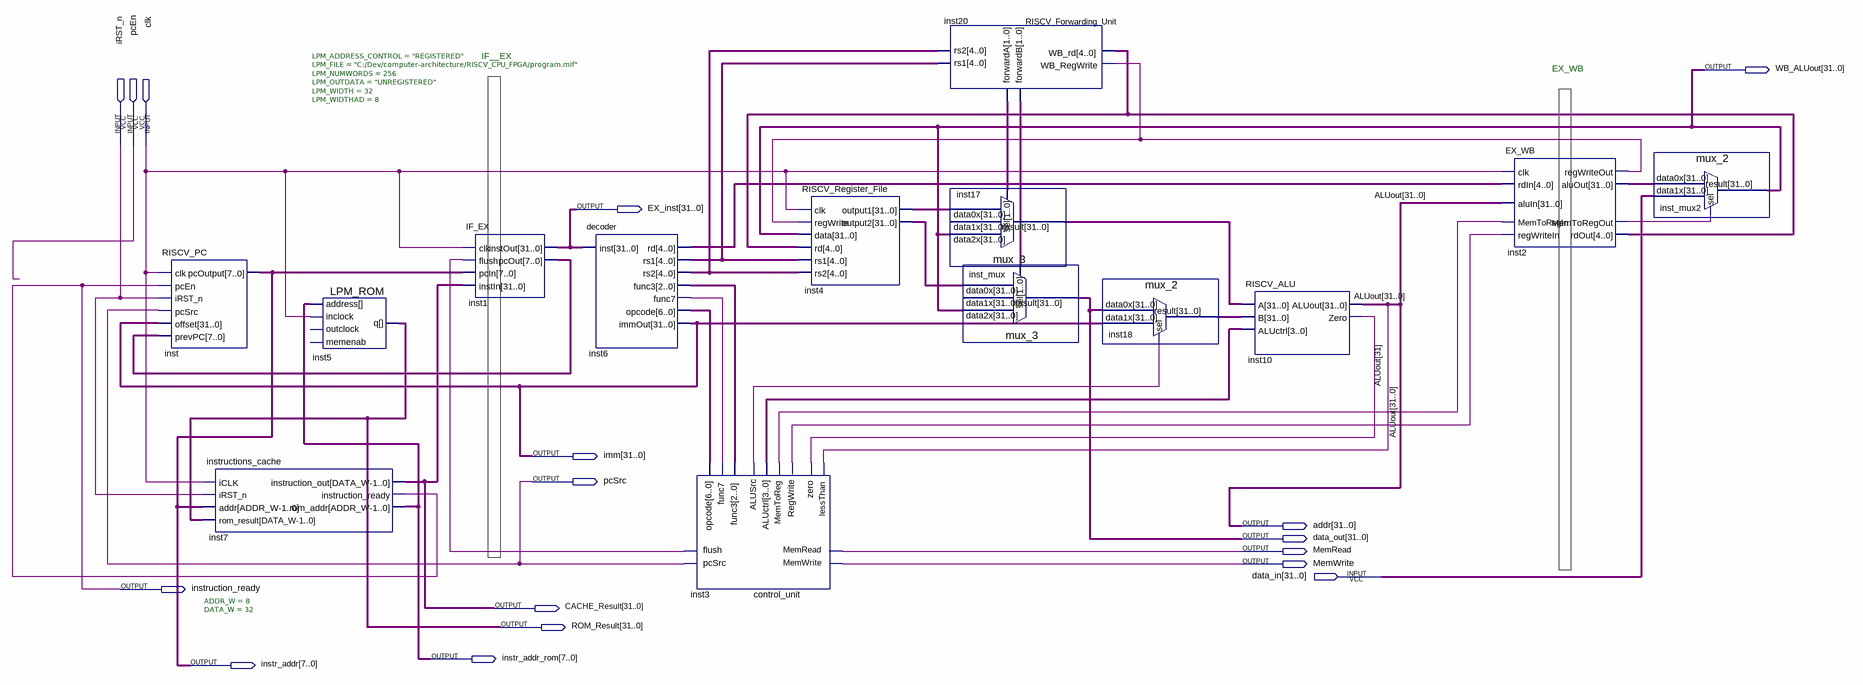
[diagram p0: schematic sheet]
// Quartus schematic CPU_pipelined.bdf as structural Verilog: 14 symbols, 17 pins
module CPU_pipelined (
  input  iRST_n,
  input  pcEn,
  input  clk,
  input  [31:0] data_in,
  output [31:0] WB_ALUout,
  output [31:0] EX_inst,
  output [31:0] imm,
  output pcSrc,
  output [31:0] addr,
  output [31:0] data_out,
  output MemRead,
  output MemWrite,
  output instruction_ready,
  output [31:0] CACHE_Result,
  output [31:0] ROM_Result,
  output [7:0] instr_addr_rom,
  output [7:0] instr_addr
);

  wire inst2_memtoregout, inst2_regwriteout, inst3_alusrc, inst3_flush, inst3_memtoreg, inst3_regwrite,
       inst6_func7, inst10_zero;
  wire [1:0] inst20_forwarda, inst20_forwardb;
  wire [2:0] inst6_func3;
  wire [3:0] inst3_aluctrl;
  wire [4:0] inst2_rdout, inst6_rd, inst6_rs1, inst6_rs2;
  wire [6:0] inst6_opcode;
  wire [7:0] inst1_pcout;
  wire [31:0] inst2_aluout, inst4_output1, inst4_output2, inst17_result, inst18_result;

  RISCV_PC inst (
    .clk(clk), .iRST_n(iRST_n), .pcSrc(pcSrc), .pcEn(instruction_ready), .offset(imm), .prevPC(inst1_pcout),
    .pcOutput(instr_addr));
  instructions_cache #(.ADDR_W(8), .DATA_W(32)) inst7 (
    .iCLK(clk), .iRST_n(iRST_n), .addr(instr_addr), .rom_result(ROM_Result), .instruction_out(CACHE_Result),
    .instruction_ready(instruction_ready), .rom_addr(instr_addr_rom));
  LPM_ROM #(.LPM_ADDRESS_CONTROL("REGISTERED"), .LPM_FILE("C:/Dev/computer-architecture/RISCV_CPU_FPGA/program.mif"), .LPM_NUMWORDS(256), .LPM_OUTDATA("UNREGISTERED"), .LPM_WIDTH(32), .LPM_WIDTHAD(8)) inst5 (
    .address(instr_addr_rom), .inclock(clk), .q(ROM_Result));  // open: outclock, memenab
  IF_EX inst1 (
    .clk(clk), .flush(inst3_flush), .pcIn(instr_addr), .instIn(CACHE_Result), .pcOut(inst1_pcout),
    .instOut(EX_inst));
  decoder inst6 (
    .inst(EX_inst), .rd(inst6_rd), .rs1(inst6_rs1), .rs2(inst6_rs2), .func3(inst6_func3),
    .func7(inst6_func7), .immOut(imm), .opcode(inst6_opcode));
  control_unit inst3 (
    .opcode(inst6_opcode), .func3(inst6_func3), .func7(inst6_func7), .zero(inst10_zero), .lessThan(addr[31]),
    .ALUctrl(inst3_aluctrl), .flush(inst3_flush), .pcSrc(pcSrc), .ALUSrc(inst3_alusrc),
    .RegWrite(inst3_regwrite), .MemToReg(inst3_memtoreg), .MemRead(MemRead), .MemWrite(MemWrite));
  RISCV_Register_File inst4 (
    .clk(clk), .regWrite(inst2_regwriteout), .data(WB_ALUout), .rd(inst2_rdout), .rs1(inst6_rs1),
    .rs2(inst6_rs2), .output1(inst4_output1), .output2(inst4_output2));
  RISCV_Forwarding_Unit inst20 (
    .WB_RegWrite(inst2_regwriteout), .WB_rd(inst2_rdout), .rs1(inst6_rs1), .rs2(inst6_rs2),
    .forwardA(inst20_forwarda), .forwardB(inst20_forwardb));
  mux_3 inst17 (
    .data2x(WB_ALUout), .data0x(inst4_output1), .sel(inst20_forwarda), .result(inst17_result));  // open: data1x
  mux_3 inst_mux (
    .data2x(WB_ALUout), .data0x(inst4_output2), .sel(inst20_forwardb), .result(data_out));  // open: data1x
  mux_2 inst18 (.data1x(imm), .data0x(data_out), .sel(inst3_alusrc), .result(inst18_result));
  RISCV_ALU inst10 (.A(inst17_result), .B(inst18_result), .ALUctrl(inst3_aluctrl), .ALUout(addr), .Zero(inst10_zero));
  EX_WB inst2 (
    .regWriteIn(inst3_regwrite), .MemToRegIn(inst3_memtoreg), .clk(clk), .rdIn(inst6_rd), .aluIn(addr),
    .regWriteOut(inst2_regwriteout), .MemToRegOut(inst2_memtoregout), .rdOut(inst2_rdout),
    .aluOut(inst2_aluout));
  mux_2 inst_mux2 (.data1x(data_in), .data0x(inst2_aluout), .sel(inst2_memtoregout), .result(WB_ALUout));

  // Other names for the same wires on the sheet: ALUout[31:0] = addr

  // Notes on the sheet:
  //   IF__EX
  //   EX_WB
endmodule
